# EAGLE design RS232_SelfPowered_Opto (EAGLE 7.6.0)
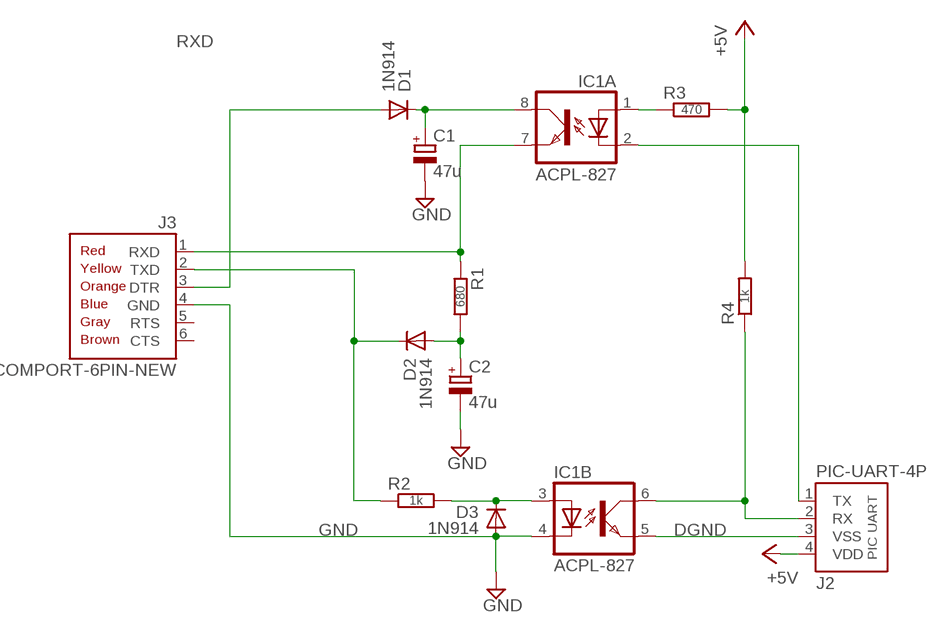
[diagram p0: schematic, sheet 1]

## Parts
C1  47u  CPOL-EUE2.5-5  [E2,5-5]
C2  47u  CPOL-EUE2.5-5  [E2,5-5]
D1  1N914  1N414834-7V  [DO34-7V]
D2  1N914  1N414834-7  [DO34-7]
D3  1N914  1N414834-7V  [DO34-7V]
IC1  ACPL-827  [DIL08]
J2  PIC-UART-4P  [CONN-4P]
J3  COMPORT-6PIN-NEW  [RS232-6PIN-NEW]
R1  680  R0202/7  [0202/7]
R2  1k  R0202/7  [0202/7]
R3  470  R0202/10-V  [0202/10-V]
R4  1k  R0202/7-V  [0202/7-V]

## Nets
+5V: J2.4(VDD) R3.2 R4.2
DGND: IC1.5(B:EMIT) J2.3(VSS)
DTR: D1.A J3.3(DTR)
GND: C1.- C2.- D3.A IC1.4(B:C) J3.4(GND)
N$2: C1.+ D1.C IC1.8(A:COL)
N$3: IC1.1(A:A) R3.1
N$4: IC1.2(A:C) J2.1(TX)
N$5: IC1.6(B:COL) J2.2(RX) R4.1
N$6: D3.C IC1.3(B:A) R2.2
N$9: C2.+ D2.A R1.2
RXD: IC1.7(A:EMIT) J3.1(RXD) R1.1
TXD: D2.C J3.2(TXD) R2.1
Unconnected: J3.5(RTS) J3.6(CTS)

## Library data of the parts
C1 C2 = rcl:CPOL-EU: POLARIZED CAPACITOR, European symbol
D1-D3 = d:1N4148
IC1 = opto-c:ACPL-827
J2 = pinconn:PIC-UART
J3 = pinconn:COMPORT-6PIN-NEW
R1-R4 = r:R: RESISTOR, European symbol

## Net classes
0 default: drill 0.001 mm

## Board
RS232 Adapter using ACPL-827 Optocouplers Powered by PIC
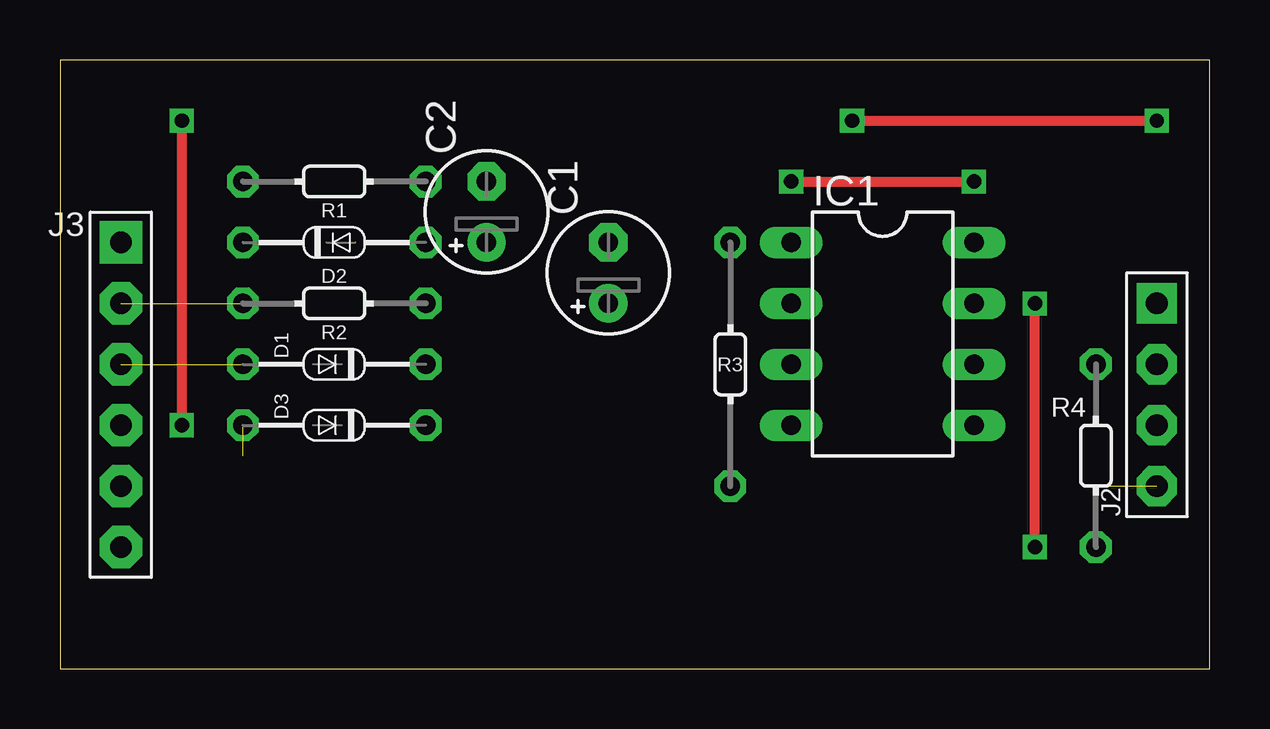
[diagram p1: board, top side]
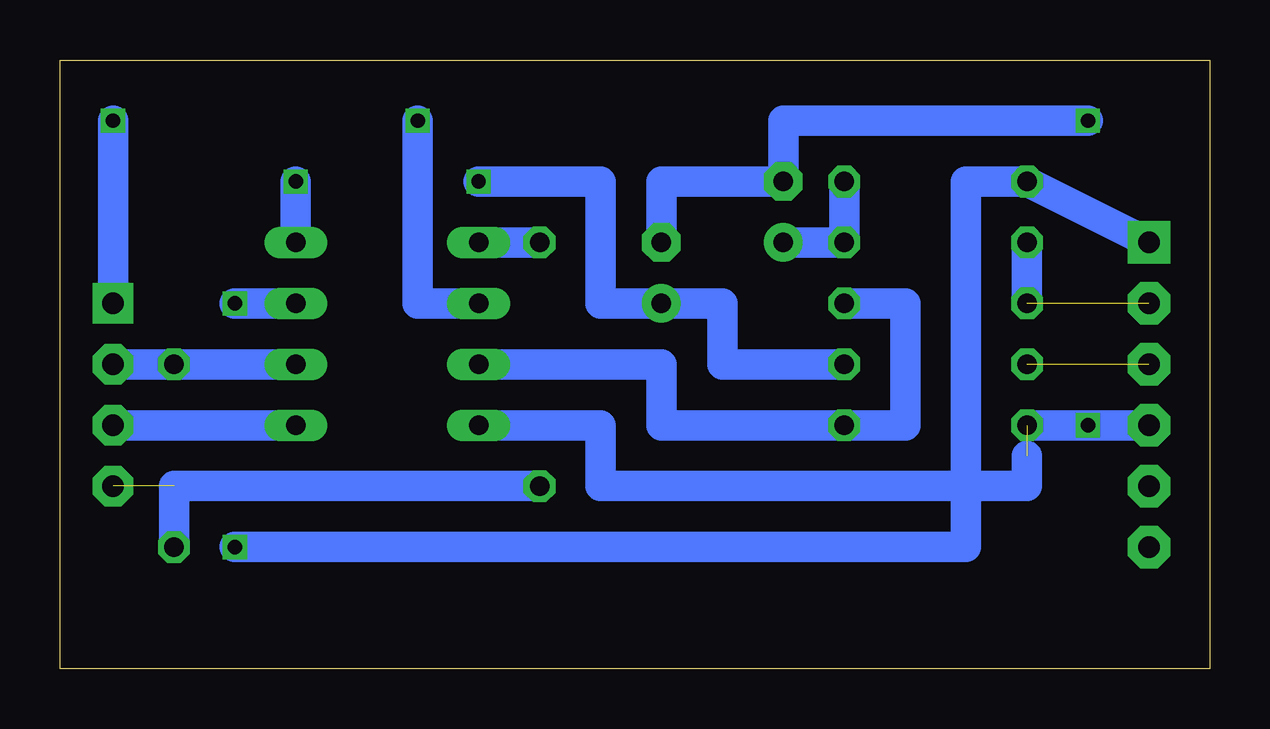
[diagram p2: board, bottom side, seen from below]

Size 47.93 x 25.39 mm. Coordinates in mm from the lower left corner, seen from the top.
Outline: 0,0 47.93,0 47.93,25.39 0,25.39 0,0
Copper layers (1*16): Top 0.035mm / dielectric 1.5mm / Bottom 0.035mm
Design rules "default": minimum track width 10mil, minimum drill 24mil, track to track 8mil, track to pad 8mil, pad to pad 8mil, via to via 8mil, smd to smd 8mil, copper to edge 40mil, drill to drill 8mil, minimum pad ring 10mil, minimum via ring 8mil, stop-mask expansion 4mil, vias tented up to drill 0mil, thermal gap 10mil

### Footprints (pad centres in the part's own frame; a part is rotated, then mirrored left to right if it is on the bottom)
E2,5-5 = drill 0.813 pad 1.6: + -1.27,0 | drill 0.813 pad 1.6 octagon: - 1.27,0
DO34-7V = drill 0.813 octagon: A 0,3.81; C 0,-3.81
DO34-7 = drill 0.813 octagon: A -3.81,0; C 3.81,0
DIL08 = drill 0.813 long: 1 -3.81,-3.81; 2 -1.27,-3.81; 3 1.27,-3.81; 4 3.81,-3.81; 5 3.81,3.81; 6 1.27,3.81; 7 -1.27,3.81; 8 -3.81,3.81
CONN-4P = drill 0.9 pad 1.676 square: 1 -3.81,0 | drill 0.9 pad 1.676 octagon: 2 -1.27,0; 3 1.27,0; 4 3.81,0
RS232-6PIN-NEW = drill 0.9 pad 1.778 square: 1 0,-6.35 | drill 0.9 pad 1.778 octagon: 2 0,-3.81; 3 0,-1.27; 4 0,1.27; 5 0,3.81; 6 0,6.35
0202/7 = drill 0.813 octagon: 1 -3.81,0; 2 3.81,0
0202/10-V = drill 0.813 octagon: 1 0,-5.08; 2 0,5.08
0202/7-V = drill 0.813 octagon: 1 0,-3.81; 2 0,3.81

### Placement (x,y rotation side)
C1  22.86,16.51 90 top
C2  17.78,19.05 90 top
D1  11.43,12.7 90 top
D2  11.43,17.78 180 top
D3  11.43,10.16 90 top
IC1  34.29,13.97 270 top
J2  45.72,11.43 270 top
J3  2.54,11.43 180 top
R1  680Ω  [0202/7]  11.43,20.32 0 top
R2  1kΩ  [0202/7]  11.43,15.24 0 top
R3  470Ω  [0202/10-V]  27.94,12.7 180 top
R4  1kΩ  [0202/7-V]  43.18,8.89 180 top

### Tracks (layer width: path | path; a pad name or v marks a point on that pad's centre or on a via)
+5V  (1 unrouted)
  Bottom 1.27: R3.2 43.18,7.62 R4.2
DGND
  Bottom 1.27: J2.3 IC1.5
DTR  (1 unrouted)
GND  (via drill 0.6)  (1 unrouted)
  Top 0.406: v5.08,22.86 v5.08,10.16
  Bottom 1.27: D3.A v5.08,10.16 J3.4 | v5.08,22.86 17.78,22.86 C2.- 22.86,20.32 C1.- | IC1.4 25.4,10.16 25.4,7.62 7.62,7.62 7.62,8.89
N$2  (via drill 0.6)
  Top 0.406: v30.48,20.32 v38.1,20.32
  Bottom 1.27: D1.C 20.32,12.7 20.32,15.24 C1.+ 25.4,15.24 25.4,20.32 v30.48,20.32 | v38.1,20.32 IC1.8
  other vias: 22.86,15.24
N$3
  Bottom 1.27: R3.1 IC1.1
N$4  (via drill 0.6)
  Top 0.406: v33.02,22.86 v45.72,22.86
  Bottom 1.27: IC1.2 33.02,15.24 v33.02,22.86 | v45.72,22.86 J2.1
N$5
  Bottom 1.27: J2.2 R4.1 IC1.6
N$6
  Bottom 1.27: R2.2 12.7,15.24 12.7,10.16 D3.C 22.86,10.16 22.86,12.7 IC1.3
N$9
  Bottom 1.27: C2.+ D2.A R1.2
RXD  (via drill 0.6)
  Top 0.406: v40.64,5.08 v40.64,15.24
  Bottom 1.27: J3.1 R1.1 10.16,20.32 10.16,5.08 v40.64,5.08 | v40.64,15.24 IC1.7
TXD  (1 unrouted)
  Bottom 1.27: R2.1 D2.C